# Altium project nha-sau.PrjPcb
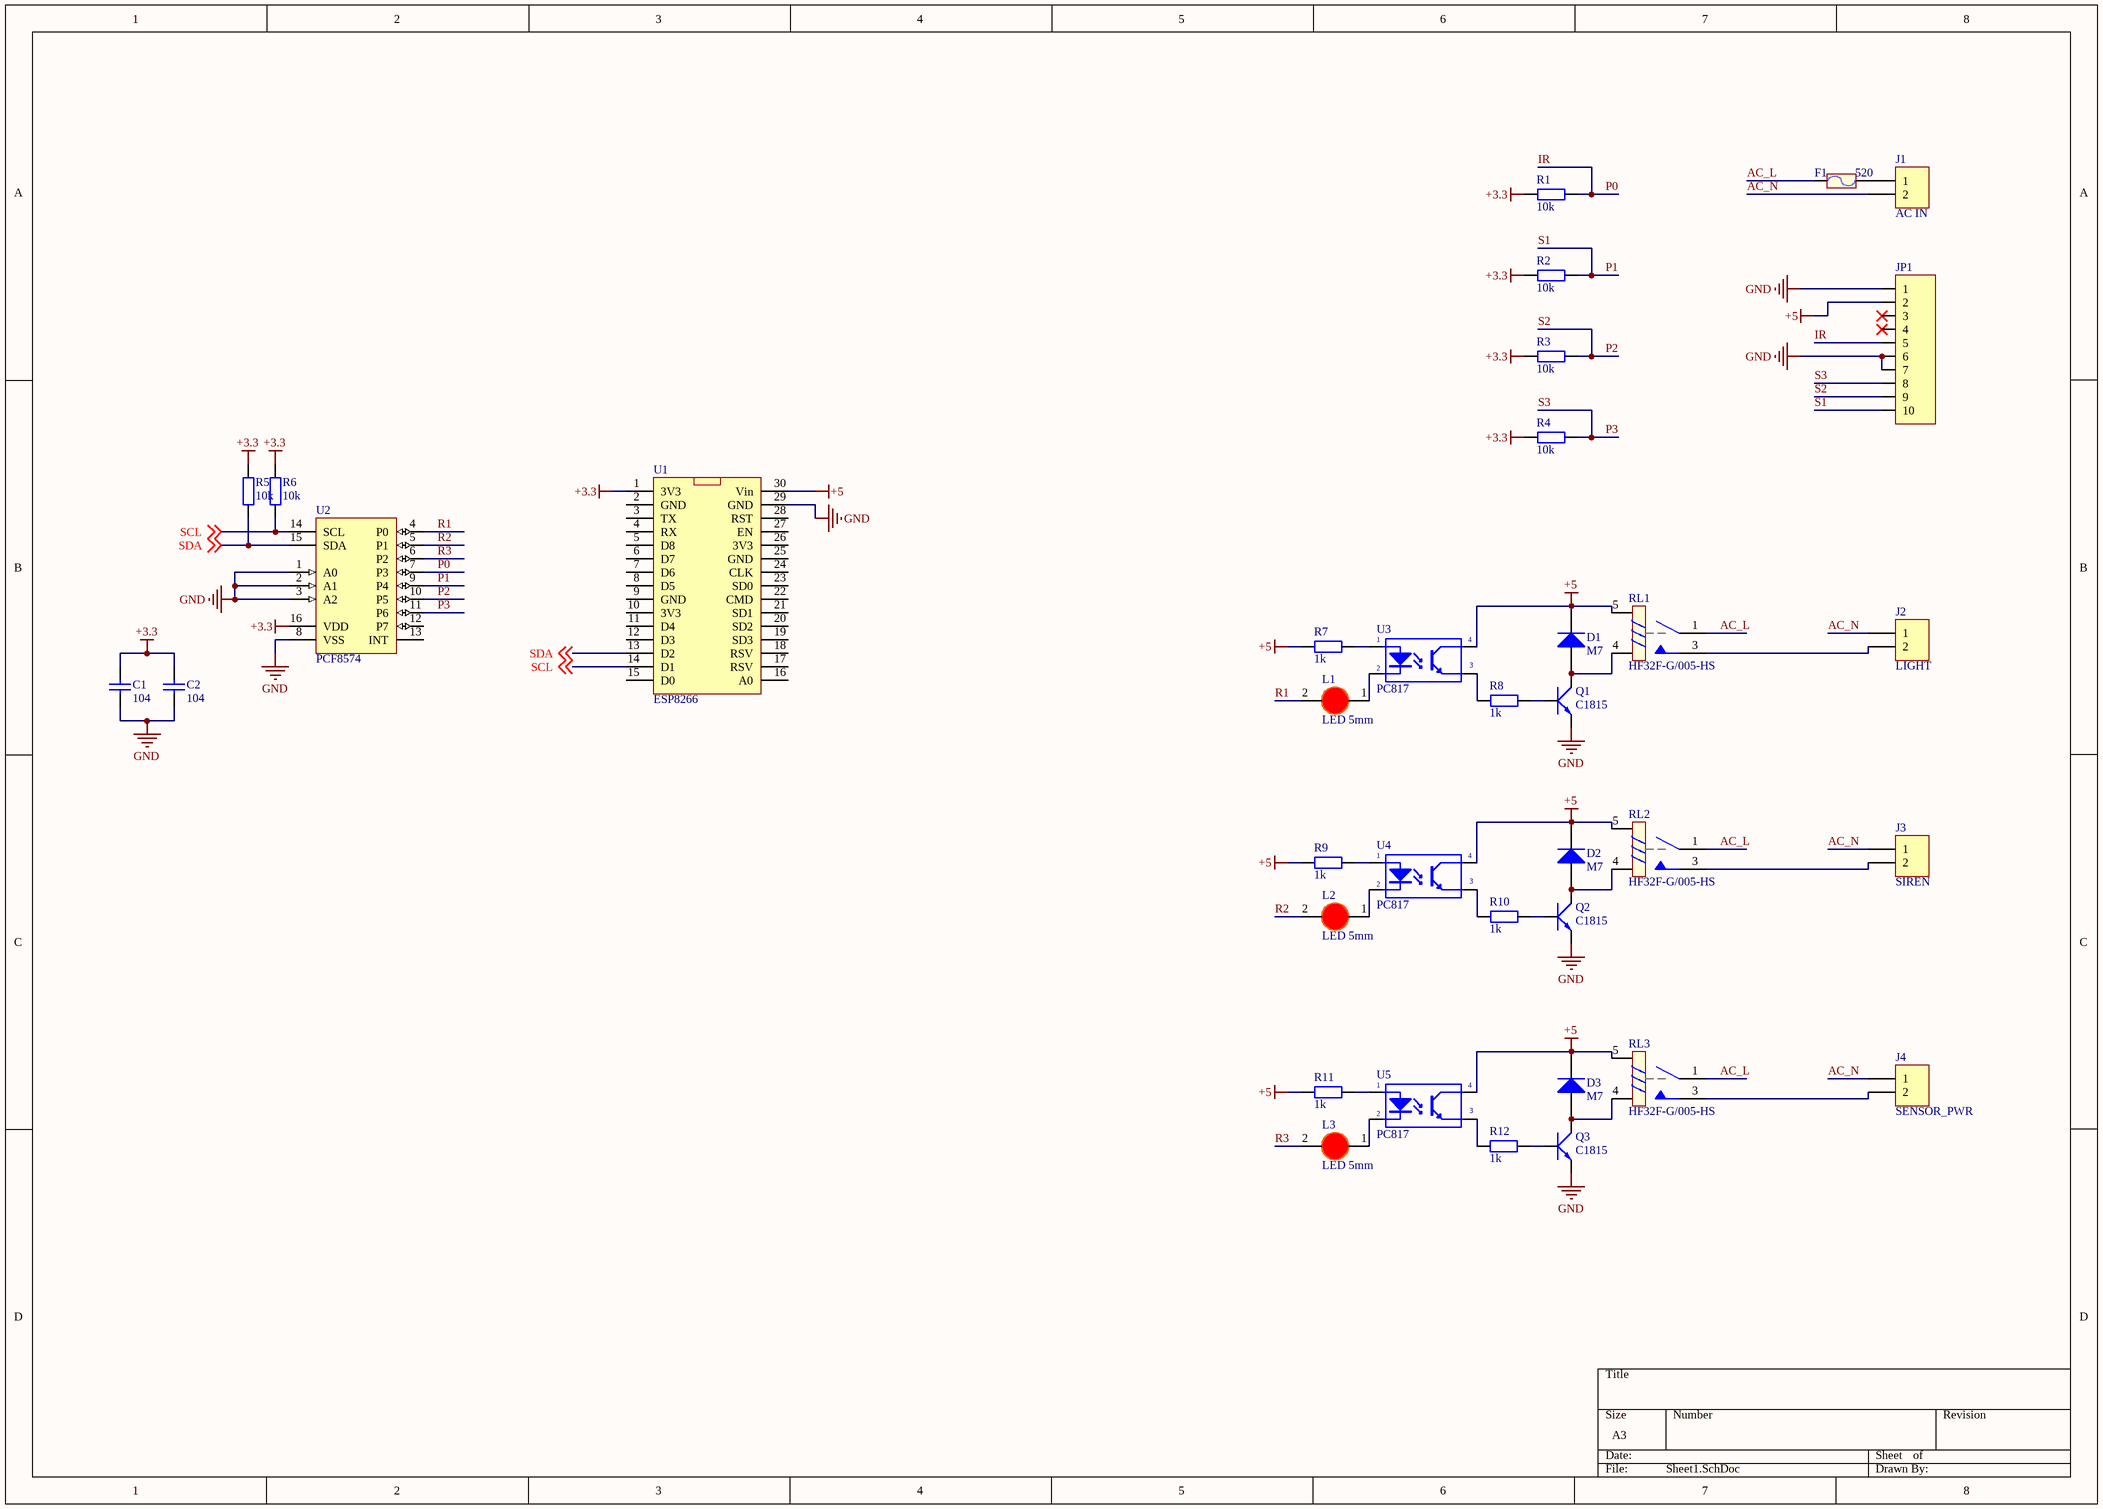
[diagram p0: Sheet1.SchDoc]
1 sheet, 37 parts. Net scope: global (net labels, ports and power ports of the same name join across sheets).
Board file: PCB1.PcbDoc

## Sheet Sheet1.SchDoc
size A3; SheetNumber: 1; SheetTotal: 1

### Parts
C1  104  [tu 0805]
C2  104  [tu 0805]
D1  M7  [DIODE SMA]
D2  M7  [DIODE SMA]
D3  M7  [DIODE SMA]
F1  520  [De Cau Chi 520 630]
J1  AC IN  [CON 2 2EDG5.08 B]
J2  LIGHT  [CON 2 2EDG5.08 B]
J3  SIREN  [CON 2 2EDG5.08 B]
J4  SENSOR_PWR  [CON 2 2EDG5.08 B]
JP1  JP 1x10 2.54  [JP 1x10 CC]  (value not drawn)
L1  LED 5mm  [LED-5MM-RED]
L2  LED 5mm  [LED-5MM-RED]
L3  LED 5mm  [LED-5MM-RED]
Q1  C1815  [TO92]
Q2  C1815  [TO92]
Q3  C1815  [TO92]
R1  10k  [tro smd 0805]
R2  10k  [tro smd 0805]
R3  10k  [tro smd 0805]
R4  10k  [tro smd 0805]
R5  10k  [tro smd 0805]
R6  10k  [tro smd 0805]
R7  1k  [tro smd 0805]
R8  1k  [tro smd 0805]
R9  1k  [tro smd 0805]
R10  1k  [tro smd 0805]
R11  1k  [tro smd 0805]
R12  1k  [tro smd 0805]
RL1  HF32F-G/005-HS  [HF32F-G]
RL2  HF32F-G/005-HS  [HF32F-G]
RL3  HF32F-G/005-HS  [HF32F-G]
U1  ESP8266  [NODE MCU CH340]
U2  PCF8574  [DIP16]
U3  PC817  [DIP4]
U4  PC817  [DIP4]
U5  PC817  [DIP4]

### Nets
+3.3: C1.1 C2.1 R1.1 R2.1 R3.1 R4.1 R5.2 R6.2 U1.1(3V3) U2.16(VDD)
+5: D1.2(K) D2.2(K) D3.2(K) JP1.2 R7.1 R9.1 R11.1 RL1.5 RL2.5 RL3.5 U1.30(Vin) U3.4(C) U4.4(C) U5.4(C)
GND: C1.2 C2.2 JP1.1 JP1.6 JP1.7 Q1.1(E) Q2.1(E) Q3.1(E) U1.29(GND) U2.1(A0) U2.2(A1) U2.3(A2) U2.8(VSS)
AC_L: F1.1 RL1.1 RL2.1 RL3.1
AC_N: J1.2 J2.1 J3.1 J4.1
IR: JP1.5 R1.2 U2.7(P3)  [also labelled P0]
P1: JP1.10 R2.2 U2.9(P4)  [also labelled S1]
P2: JP1.9 R3.2 U2.10(P5)  [also labelled S2]
P3: JP1.8 R4.2 U2.11(P6)  [also labelled S3]
R1: L1.2(K) U2.4(P0)
R2: L2.2(K) U2.5(P1)
R3: L3.2(K) U2.6(P2)
SCL: R6.1 U1.14(D1) U2.14(SCL) ; off-sheet SCL
SDA: R5.1 U1.13(D2) U2.15(SDA) ; off-sheet SDA
NetD1_1: D1.1(A) Q1.2(C) RL1.4
NetD2_1: D2.1(A) Q2.2(C) RL2.4
NetD3_1: D3.1(A) Q3.2(C) RL3.4
NetF1_2: F1.2 J1.1
NetJ2_2: J2.2 RL1.3
NetJ3_2: J3.2 RL2.3
NetJ4_2: J4.2 RL3.3
NetL1_1: L1.1(A) U3.2(K)
NetL2_1: L2.1(A) U4.2(K)
NetL3_1: L3.1(A) U5.2(K)
NetQ1_3: Q1.3(B) R8.2
NetQ2_3: Q2.3(B) R10.2
NetQ3_3: Q3.3(B) R12.2
NetR7_2: R7.2 U3.1(A)
NetR8_1: R8.1 U3.3(E)
NetR9_2: R9.2 U4.1(A)
NetR10_1: R10.1 U4.3(E)
NetR11_2: R11.2 U5.1(A)
NetR12_1: R12.1 U5.3(E)

Not connected (* = marked no-connect by the designer): JP1 3* 4*; U1 2(GND) 3(TX) 4(RX) 5(D8) 6(D7) 7(D6) 8(D5) 9(GND) 10(3V3) 11(D4) 12(D3) 15(D0) 16(A0) 17(RSV) 18(RSV) 19(SD3) 20(SD2) 21(SD1) 22(CMD) 23(SD0) 24(CLK) 25(GND) 26(3V3) 27(EN) 28(RST); U2 12(P7) 13(INT)

### Library data of the parts
C1 C2 = Tu 0805 104 50V 10%: Dán; Don_Vi: Con; So_Chan: 2; Ten_Linh_Kien: Tụ 0805 104-100nF 10% 50V; Ma_Hang: MH004551; Chung_Loai: Dán; Kieu_Chan: *
D1-D3 = Diode M7 ( 4007 ): Dán; Ten_Linh_Kien: Diode M7 1N4007 SMD 1A 1000V; Don_Vi: Con; Ma_Hang: MH000944; Chung_Loai: Dán; Ghi_Chu: *
F1 = De Cau Chi 520 630: 5x20mm; Ma_Hang: MH001473; Ten: Đế Cầu Chì 5x20MM 6x30MM SMD01
J1-J4 = CON 2 EDG5.08: CON2 KF terminal
JP1 = JP 1x10 2.54 Cai Cong: Cắm; Ten_Linh_Kien: Jump Đơn Cái 2.54MM 1x40P Cong; Don_Vi: Con; Ma_Hang: MH001265; Ghi_Chu: *; Kieu_Chan: *; Chung_Loai: Cắm
L1-L3 = LED 5mm Do: Cắm; Don_Vi: Con; Ma_Hang: MH008967; Ten_Linh_Kien: Led 5MM Phủ Đỏ (1000c); Ghi_Chu: *; Kieu_Chan: *; Chung_Loai: Cắm
Q1-Q3 = Trans C1815 DIP: NPN transistor; Value: C9014
R1-R6 = Tro 0805 1% 10k: Dán; Don_Vi: Con; So_Chan: 2; Ten_Linh_Kien: Trở 0805 1% 10k; Ma_Hang: MH005473; Chung_Loai: Dán; Kieu_Chan: *
R7-R12 = Tro 0805 1% 1k: Dán; Don_Vi: Con; So_Chan: 2; Ten_Linh_Kien: Trở 0805 1% 1k; Ma_Hang: MH005468; Chung_Loai: Dán; Kieu_Chan: *
RL1-RL3 = Relay HF 10A: Relay hongfa 10A 4P HF32F-G/005-HS
U1 = NODEMCU 1.0: ESP8266 nodemcu 1.0
U3-U5 = PC817: Single Opto; Value: PC817